# EAGLE design ATTAMI-Shield-template (EAGLE 7.1.0)
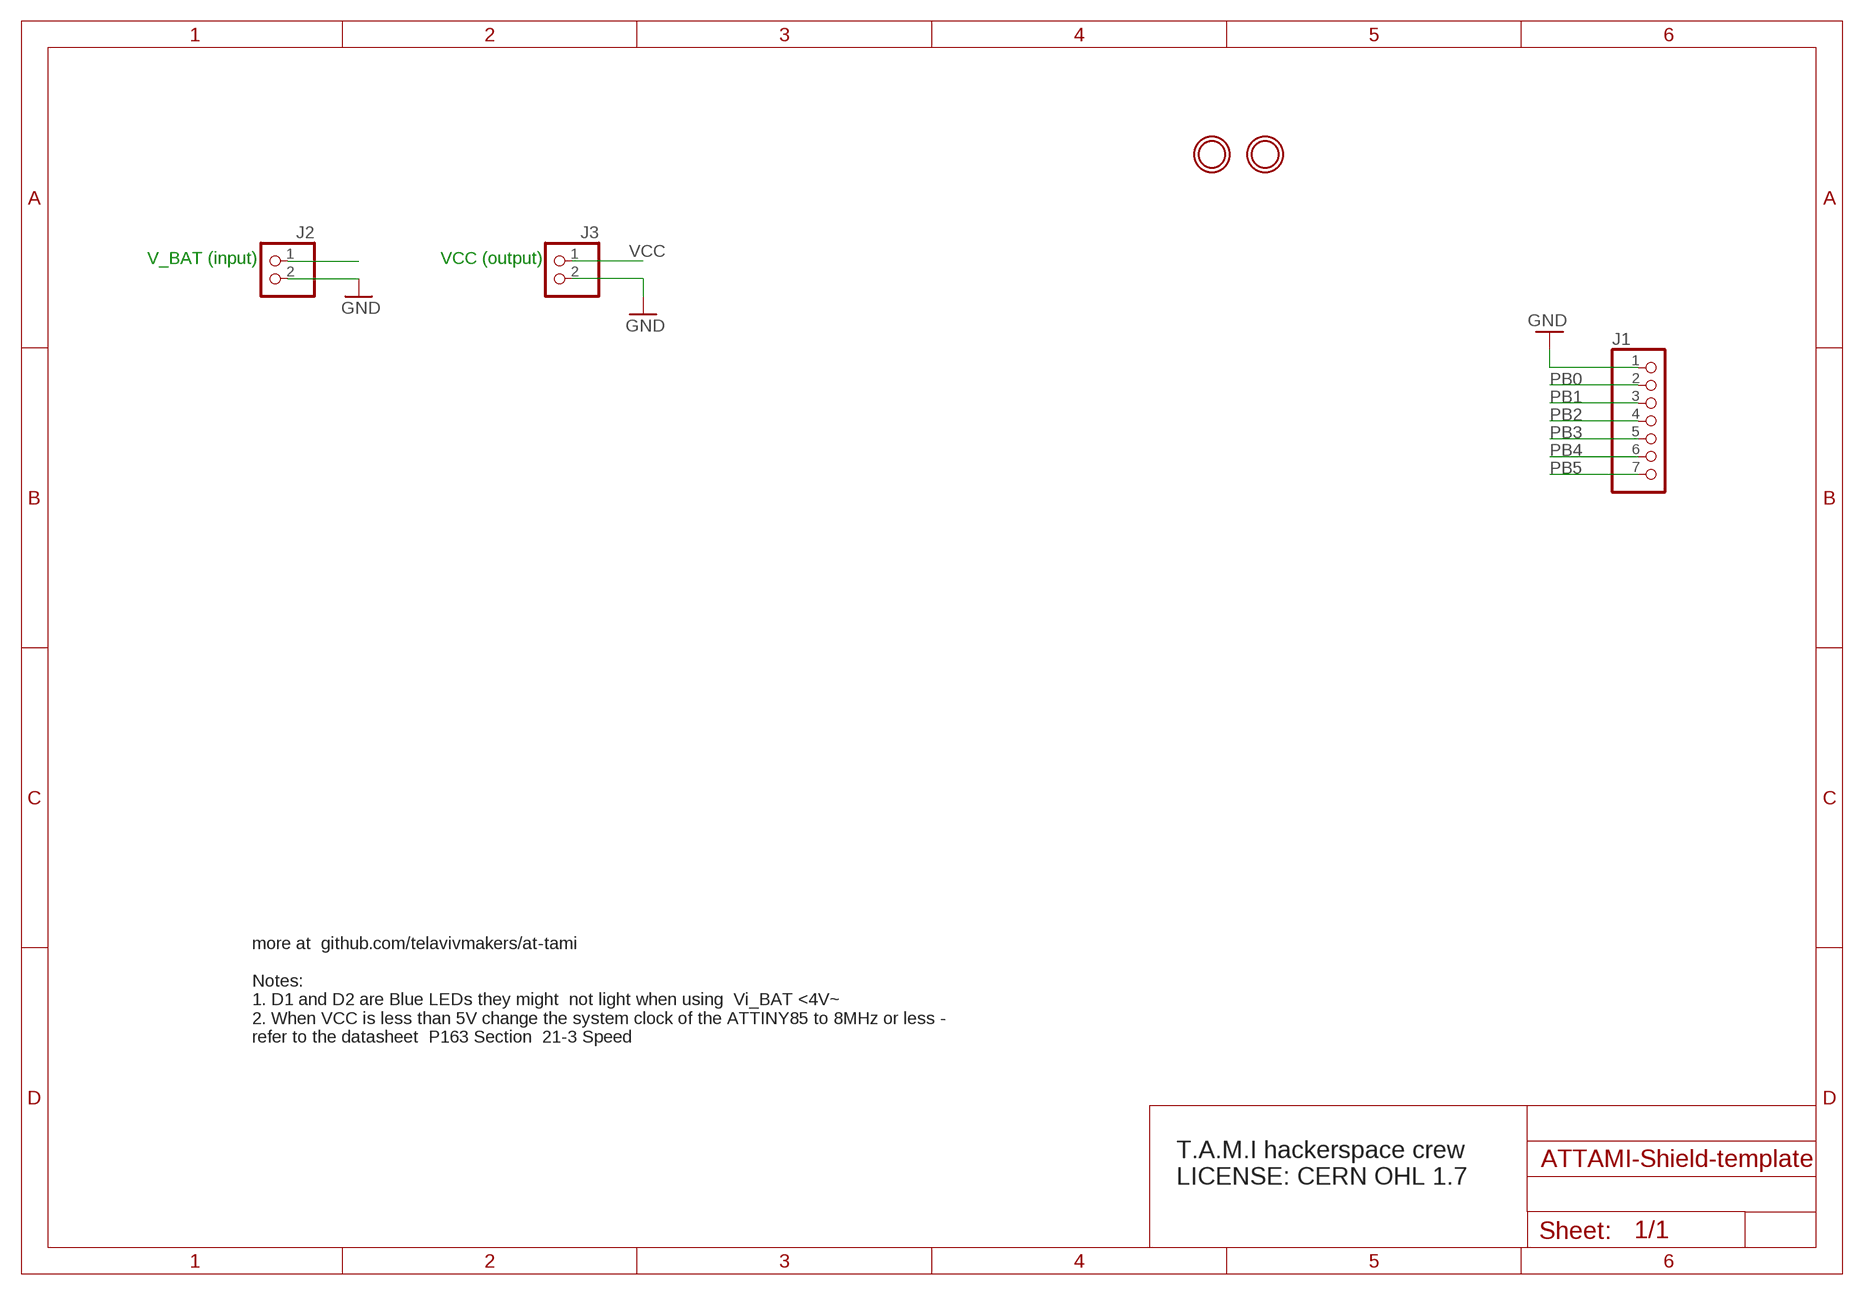
[diagram p0: schematic, sheet 1]

## Parts
J1  HEADER-1X7ROUND  [1X07_ROUND]
J2  HEADER-1X2ROUND  [1X02_ROUND]
J3  HEADER-1X2ROUND  [1X02_ROUND]
U$1  MOUNTINGHOLE2.0  [MOUNTINGHOLE_2.0_PLATED]
U$2  MOUNTINGHOLE2.0  [MOUNTINGHOLE_2.0_PLATED]

## Nets
GND: J1.1 J2.2 J3.2
N$3: J2.1
PB0: J1.2
PB1: J1.3
PB2: J1.4
PB3: J1.5
PB4: J1.6
PB5: J1.7
VCC: J3.1

## Notes on the sheet
- V_BAT (input) | VCC (output)
- more at  github.com/telavivmakers/at-tami
  
  Notes: 
  1. D1 and D2 are Blue LEDs they might  not light when using  Vi_BAT <4V~  
  2. When VCC is less than 5V change the system clock of the ATTINY85 to 8MHz or less - 
  refer to the datasheet  P163 Section  21-3 Speed
- T.A.M.I hackerspace crew 
  LICENSE: CERN OHL 1.7

## Library data of the parts
J1 = microbuilder:HEADER-1X7: PIN HEADER
J2 J3 = microbuilder:HEADER-1X2: PIN HEADER
U$1 U$2 = microbuilder:MOUNTINGHOLE: Mounting Hole For #2 screws (0.086"/2.18mm width, 0.094"/2.4mm hole) use 2.5mm

## Net classes
0 default: width 0.203 mm
1 vcc: width 0.254 mm

## Board
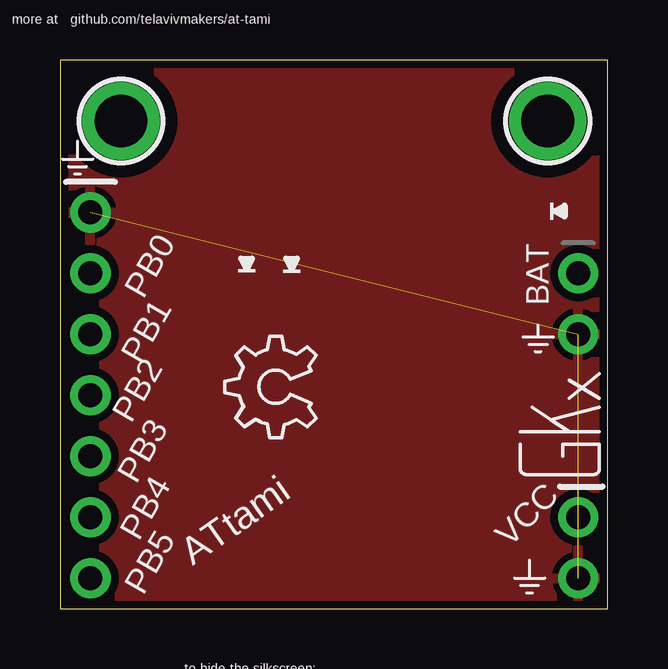
[diagram p1: board, top side]
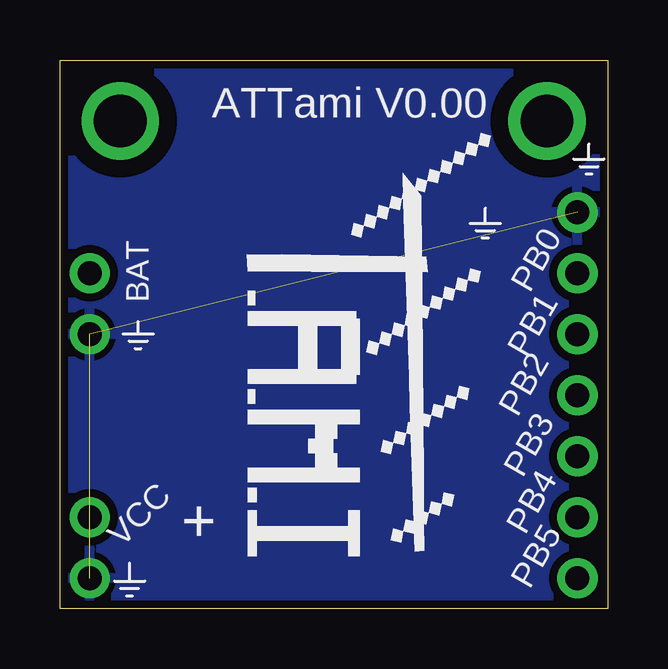
[diagram p2: board, bottom side, seen from below]

Size 22.83 x 22.86 mm. Coordinates in mm from the lower left corner, seen from the top.
Outline: 0,0 22.83,0 22.83,22.86 0,22.86 0,0
Copper layers (1*16): Top 0.035mm / dielectric 1.5mm / Bottom 0.035mm
Design rules "dirt_cheap_dirty_boards.v1": minimum track width 5mil, minimum drill 12mil, track to track 5mil, track to pad 5mil, pad to pad 5mil, via to via 5mil, smd to smd 0mil, copper to edge 10mil, drill to drill 10mil, minimum pad ring 10mil, minimum via ring 6mil, stop-mask expansion 2mil, vias tented up to drill 25mil, thermal gap 10mil

### Footprints (pad centres in the part's own frame; a part is rotated, then mirrored left to right if it is on the bottom)
1X07_ROUND = drill 1 pad 1.676: 1 -7.62,0; 2 -5.08,0; 3 -2.54,0; 4 0,0; 5 2.54,0; 6 5.08,0; 7 7.62,0
1X02_ROUND = drill 1 pad 1.676: 1 -1.27,0; 2 1.27,0
MOUNTINGHOLE_2.0_PLATED = drill 2.2 pad 3: P$1 0,0

### Placement (x,y rotation side)
J1  1.27,8.89 270 top
J2  21.59,12.7 270 top
J3  21.59,2.54 270 top
U$1  2.54,20.32 270 top
U$2  20.32,20.32 0 top
U$3  [OSHW_6X150_NOTEXT]  10.67,7.11 90 top

### Tracks (layer width: path | path; a pad name or v marks a point on that pad's centre or on a via)
GND  (2 unrouted)
  pour Bottom (isolate 0.33): 23.37,23.75 -1.52,23.62 -1.21,-1.43 23.37,-1.02
  pour Top (isolate 0.33): -1.02,23.5 -1.02,-0.51 23.62,-0.51 23.3,23.53

### Text on the board
tPlace: more at github.com/telavivmakers/at-tami | to hide the silkscreen: / disable layers: tNames, bNames, tPlace, bPlace
bPlace: BAT | PB0 | PB1 | PB2 | PB3 | PB4 | + | VCC | PB5
tNames: BAT | PB0 | PB1 | PB2 | ATtami | PB3 | PB4 | VCC | PB5
bNames: ATTami V0.00
tTest: J2